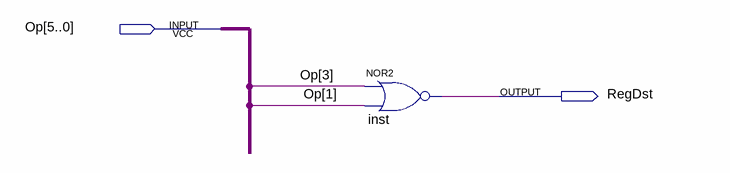
[diagram p0: schematic sheet]
// Quartus schematic RegDstDecoder.bdf as structural Verilog: 1 symbols, 2 pins
module RegDstDecoder (
  input  [5:0] Op,
  output RegDst
);

  nor inst (RegDst, Op[3], Op[1]);
endmodule
